# EAGLE schematic 4x4v3 (EAGLE 8.5.0)

## Sheet 1 of 2
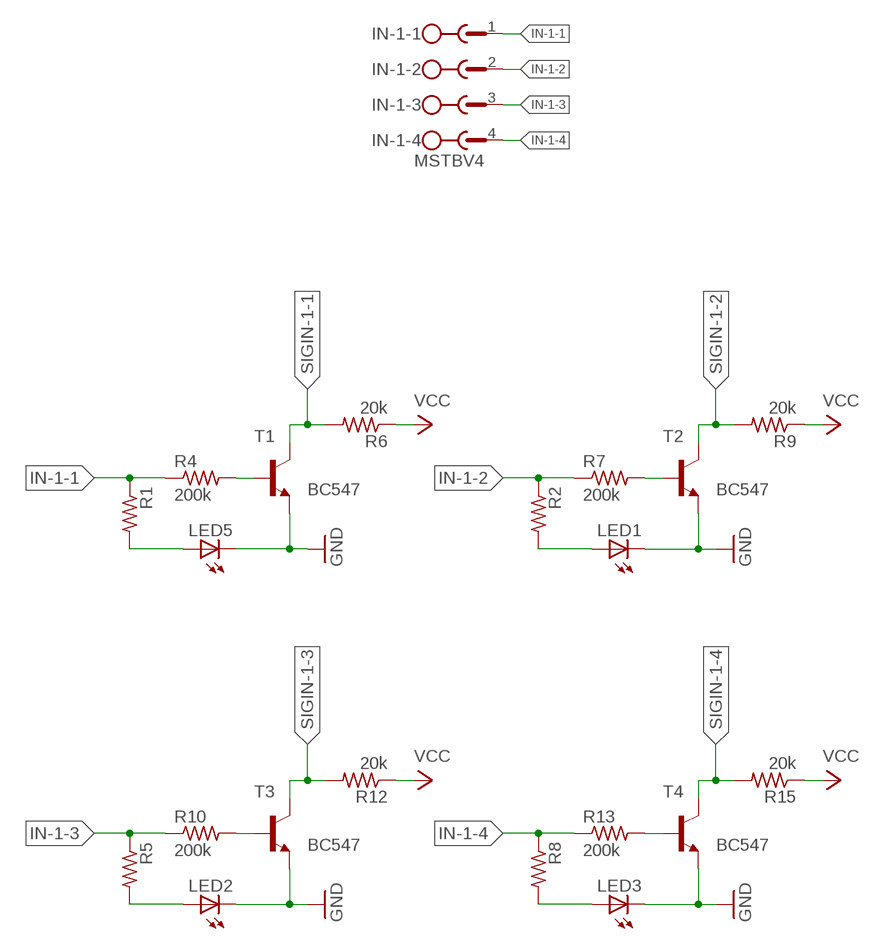
[diagram p0: schematic, sheet 1, part 1 of 2]
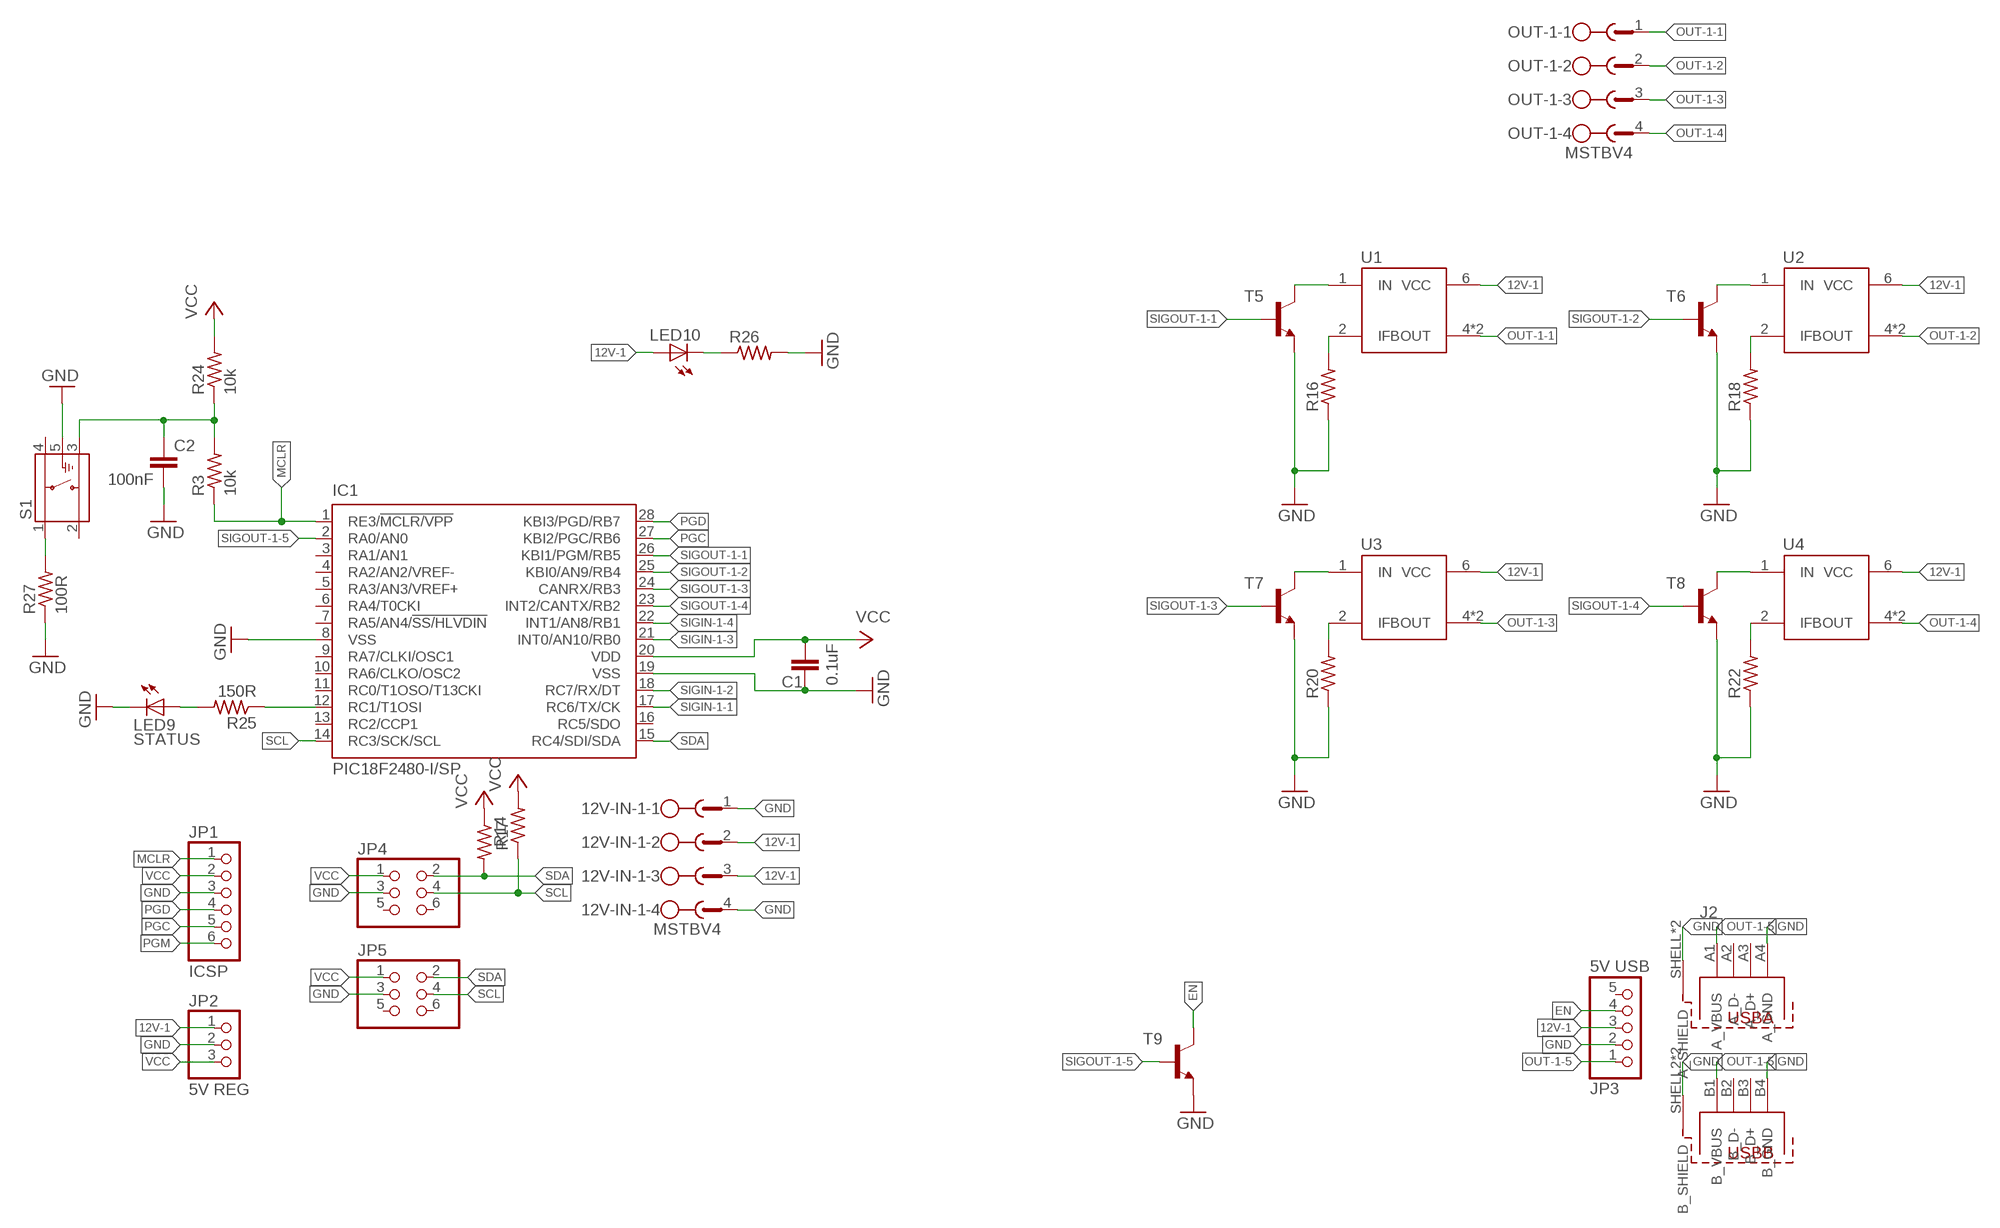
[diagram p1: schematic, sheet 1, part 2 of 2]

### Parts
12V-IN-1  MSTBV4  [MSTBV4]
C1  0.1uF  C-EU025-030X050  [C025-030X050]
C2  100nF  C-EU025-025X050  [C025-025X050]
IC1  PIC18F2480-I/SP  [DIL28-3]
IN-1  MSTBV4  [MSTBV4]
J2  614008235023  [614008235023]
JP1  ICSP  PINHD-1X6  [1X06]
JP2  5V REG  PINHD-1X3  [1X03]
JP3  5V USB  PINHD-1X5  [1X05]
JP4  PINHD-2X3  [2X03]
JP5  PINHD-2X3  [2X03]
LED1  LEDCHIPLED_0805  [CHIPLED_0805]
LED2  LEDCHIPLED_0805  [CHIPLED_0805]
LED3  LEDCHIPLED_0805  [CHIPLED_0805]
LED5  LEDCHIPLED_0805  [CHIPLED_0805]
LED9  STATUS  LEDCHIPLED_0805  [CHIPLED_0805]
LED10  LEDCHIPLED_0805  [CHIPLED_0805]
OUT-1  MSTBV4  [MSTBV4]
R1  R-US_R0805  [R0805]
R2  R-US_R0805  [R0805]
R3  10k  R-US_R0805  [R0805]
R4  200k  R-US_R0805  [R0805]
R5  R-US_R0805  [R0805]
R6  20k  R-US_R0805  [R0805]
R7  200k  R-US_R0805  [R0805]
R8  R-US_R0805  [R0805]
R9  20k  R-US_R0805  [R0805]
R10  200k  R-US_R0805  [R0805]
R12  20k  R-US_R0805  [R0805]
R13  200k  R-US_R0805  [R0805]
R14  R-US_R0805  [R0805]
R15  20k  R-US_R0805  [R0805]
R16  R-US_R0805  [R0805]
R17  R-US_R0805  [R0805]
R18  R-US_R0805  [R0805]
R20  R-US_R0805  [R0805]
R22  R-US_R0805  [R0805]
R24  10k  R-US_R0805  [R0805]
R25  150R  R-US_R0805  [R0805]
R26  R-US_R0805  [R0805]
R27  100R  R-US_R0805  [R0805]
S1  KMR421GULCLFS  [SW_KMR421GULCLFS]
T1  BC547  -NPN-SOT23-EBC  [SOT23-EBC]
T2  BC547  -NPN-SOT23-EBC  [SOT23-EBC]
T3  BC547  -NPN-SOT23-EBC  [SOT23-EBC]
T4  BC547  -NPN-SOT23-EBC  [SOT23-EBC]
T5  -NPN-SOT23-EBC  [SOT23-EBC]
T6  -NPN-SOT23-EBC  [SOT23-EBC]
T7  -NPN-SOT23-EBC  [SOT23-EBC]
T8  -NPN-SOT23-EBC  [SOT23-EBC]
T9  -NPN-SOT23-EBC  [SOT23-EBC]
U1  IR3315  [TO263-5]
U2  IR3315  [TO263-5]
U3  IR3315  [TO263-5]
U4  IR3315  [TO263-5]

### Nets
12V-1 [pwr]: 12V-IN-1.2 12V-IN-1.3 JP2.1 JP3.3 LED10.A U1.6(VCC) U2.6(VCC) U3.6(VCC) U4.6(VCC)
EN: JP3.4 T9.C
GND: 12V-IN-1.1 12V-IN-1.4 C1.2 C2.2 IC1.8(VSS) IC1.19(VSS) J2.A4(A_GND) J2.B4(B_GND) J2.SHELL1(A_SHIELD) J2.SHELL2(B_SHIELD) J2.SHELL3(B_SHIELD) J2.SHELL(A_SHIELD) JP1.3 JP2.2 JP3.2 JP4.3 JP5.3 LED1.C LED2.C LED3.C LED5.C LED9.C R16.1 R18.1 R20.1 R22.1 R26.2 R27.1 S1.5(G) T1.E T2.E T3.E T4.E T5.E T6.E T7.E T8.E T9.E
IN-1-1: IN-1.1 R1.1 R4.1
IN-1-2: IN-1.2 R2.1 R7.1
IN-1-3: IN-1.3 R5.1 R10.1
IN-1-4: IN-1.4 R8.1 R13.1
MCLR: IC1.1(RE3/!MCLR/VPP) JP1.1 R3.1
N$1: C2.1 R3.2 R24.1 S1.3
N$2: R27.2 S1.1
N$3: LED5.A R1.2
N$4: R4.2 T1.B
N$5: LED1.A R2.2
N$6: R7.2 T2.B
N$7: LED2.A R5.2
N$8: R10.2 T3.B
N$9: LED3.A R8.2
N$10: R13.2 T4.B
N$12: T5.C U1.1(IN)
N$13: R16.2 U1.2(IFB)
N$15: T6.C U2.1(IN)
N$16: R18.2 U2.2(IFB)
N$18: T7.C U3.1(IN)
N$19: R20.2 U3.2(IFB)
N$21: T8.C U4.1(IN)
N$22: R22.2 U4.2(IFB)
N$24: LED9.A R25.2
N$25: LED10.C R26.1
OUT-1-1 [pwr]: OUT-1.1 U1.4(OUT) U1.5(OUT)
OUT-1-2 [pwr]: OUT-1.2 U2.4(OUT) U2.5(OUT)
OUT-1-3 [pwr]: OUT-1.3 U3.4(OUT) U3.5(OUT)
OUT-1-4 [pwr]: OUT-1.4 U4.4(OUT) U4.5(OUT)
OUT-1-5: J2.A1(A_VBUS) J2.B1(B_VBUS) JP3.1
PGC: IC1.27(KBI2/PGC/RB6) JP1.5
PGD: IC1.28(KBI3/PGD/RB7) JP1.4
PGM: JP1.6
SCL: IC1.14(RC3/SCK/SCL) JP4.4 JP5.4 R17.1
SDA: IC1.15(RC4/SDI/SDA) JP4.2 JP5.2 R14.2
SIGIN-1-1: IC1.17(RC6/TX/CK) R6.2 T1.C
SIGIN-1-2: IC1.18(RC7/RX/DT) R9.2 T2.C
SIGIN-1-3: IC1.21(INT0/AN10/RB0) R12.2 T3.C
SIGIN-1-4: IC1.22(INT1/AN8/RB1) R15.2 T4.C
SIGOUT-1-1: IC1.26(KBI1/PGM/RB5) T5.B
SIGOUT-1-2: IC1.25(KBI0/AN9/RB4) T6.B
SIGOUT-1-3: IC1.24(CANRX/RB3) T7.B
SIGOUT-1-4: IC1.23(INT2/CANTX/RB2) T8.B
SIGOUT-1-5: IC1.2(RA0/AN0) T9.B
STATUS_LED: IC1.12(RC1/T1OSI) R25.1
VCC: C1.1 IC1.20(VDD) JP1.2 JP2.3 JP4.1 JP5.1 R6.1 R9.1 R12.1 R14.1 R15.1 R17.2 R24.2
Unconnected: IC1.3(RA1/AN1) IC1.4(RA2/AN2/VREF-) IC1.5(RA3/AN3/VREF+) IC1.6(RA4/T0CKI) IC1.7(RA5/AN4/!SS/HLVDIN) IC1.9(RA7/CLKI/OSC1) IC1.10(RA6/CLKO/OSC2) IC1.11(RC0/T1OSO/T13CKI) IC1.13(RC2/CCP1) IC1.16(RC5/SDO) J2.A2(A_D-) J2.A3(A_D+) J2.B2(B_D-) J2.B3(B_D+) JP3.5 JP4.5 JP4.6 JP5.5 JP5.6 S1.2 S1.4

## Sheet 2 of 2

## Library data of the parts
12V-IN-1 IN-1 OUT-1 = con-phoenix-508:MSTBV4: PHOENIX; MPN: MSTBV 2,5/4-GF-5.08; OC_FARNELL: 1792794; OC_NEWARK: 69R9847
C1 C2 = resistor:C-EU: CAPACITOR, European symbol
IC1 = microchip:PIC18F2*80: 28-Pin Enhanced Flash Microcontrollers with ECAN(TM) Technology 10-Bit A/D and nanoWatt Technology Source: http://www.microchip.com .. 39637a.pdf; MF: MICROCHIP; MPN: PIC18F2480-I/SP; OC_FARNELL: 9321217; OC_NEWARK: 71J7237
J2 = InputOutputIO (rev17e):614008235023: WR-COM Vertical Dual USB Type A=>Code : Con_I-O_COM_USB-2.0_A_614008235023 <http://katalog.we-online.de/media/images/eican/Con_I-O_COM_USB-2.0_A_614008235023_pf2.jpg> Details see: http://katalog.we-online.de/en/em/614_008_235_023 Created 2014-07-09, Karrer Zheng 2014 (C) Würth Elektronik
JP1 = pinhead:PINHD-1X6: PIN HEADER
JP2 = pinhead:PINHD-1X3: PIN HEADER
JP3 = pinhead:PINHD-1X5: PIN HEADER
JP4 JP5 = pinhead:PINHD-2X3: PIN HEADER
LED1-LED3 LED5 LED9 LED10 = led:LED: LED OSRAM: - CHIPLED LG R971, LG N971, LY N971, LG Q971, LY Q971, LO R971, LY R971 LH N974, LH R974 LS Q976, LO Q976, LY Q976 LO Q996 - Hyper CHIPLED LW Q18S LB Q993, LB Q99A, LB R99A - SideLED LS A670, LO A670, LY A670, LG A670, LP A670 LB A673, LV A673, LT A673, LW A673 LH A674 LY A675 LS A676, LA A676, LO A676, LY A676, LW A676 LS A679, LY A679, LG A679 - Hyper Micro SIDELED® LS Y876, LA Y876, LO Y876, LY Y876 LT Y87S - SmartLED LW L88C, LW L88S LB L89C, LB L89S, LG L890 LS L89K, LO L89K, LY L89K LS L896, LA L896, LO L896, LY L896 - TOPLED LS T670, LO T670, LY T670, LG T670, LP T670 LSG T670, LSP T670, LSY T670, LOP T670, LYG T670 LG T671, LOG T671, LSG T671 LB T673, LV T673, LT T673, LW T673 LH T674 LS T676, LA T676, LO T676, LY T676, LB T676, LH T676, LSB T676, LW T676 LB T67C, LV T67C, LT T67C, LS T67K, LO T67K, LY T67K, LW E67C LS E67B, LA E67B, LO E67B, LY E67B, LB E67C, LV E67C, LT E67C LW T67C LS T679, LY T679, LG T679 LS T770, LO T770, LY T770, LG T770, LP T770 LB T773, LV T773, LT T773, LW T773 LH T774 LS E675, LA E675, LY E675, LS T675 LS T776, LA T776, LO T776, LY T776, LB T776 LHGB T686 LT T68C, LB T68C - Hyper Mini TOPLED® LB M676 - Mini TOPLED Santana® LG M470 LS M47K, LO M47K, LY M47K Source: http://www.osram.convergy.de LUXEON: - LUMILED® LXK2-PW12-R00, LXK2-PW12-S00, LXK2-PW14-U00, LXK2-PW14-V00 LXK2-PM12-R00, LXK2-PM12-S00, LXK2-PM14-U00 LXK2-PE12-Q00, LXK2-PE12-R00, LXK2-PE12-S00, LXK2-PE14-T00, LXK2-PE14-U00 LXK2-PB12-K00, LXK2-PB12-L00, LXK2-PB12-M00, LXK2-PB14-N00, LXK2-PB14-P00, LXK2-PB14-Q00 LXK2-PR12-L00, LXK2-PR12-M00, LXK2-PR14-Q00, LXK2-PR14-R00 LXK2-PD12-Q00, LXK2-PD12-R00, LXK2-PD12-S00 LXK2-PH12-R00, LXK2-PH12-S00 LXK2-PL12-P00, LXK2-PL12-Q00, LXK2-PL12-R00 Source: www.luxeon.com KINGBRIGHT: KA-3528ASYC Source: www.kingbright.com
R1-R10 R12-R18 R20 R22 R24-R27 = resistor:R-US_: RESISTOR, American symbol
S1 = KMR421GULCLFS:KMR421GULCLFS: Switch Tactile N.O. SPST Round Button Gull Wing 0.05A 32VDC 1VA 200000Cycles 2N SMD Automotive T/R; AVAILABILITY: Good; DESCRIPTION: Switch Tactile N.O. SPST Round Button Gull Wing 0.05A 32VDC 1VA 200000Cycles 2N SMD Automotive T/R; MF: C&K Components; MP: KMR421GULCLFS; PACKAGE: None; PRICE: 0.30 USD
T1-T9 = transistor:*-NPN-: NPN Transistror BF959 corrected 2008.03.06
U1-U4 = jgennari:IR3315

## Net classes
0 default: width 0.203 mm, drill 0.305 mm
1 pwr: width 0.559 mm, drill 0.305 mm